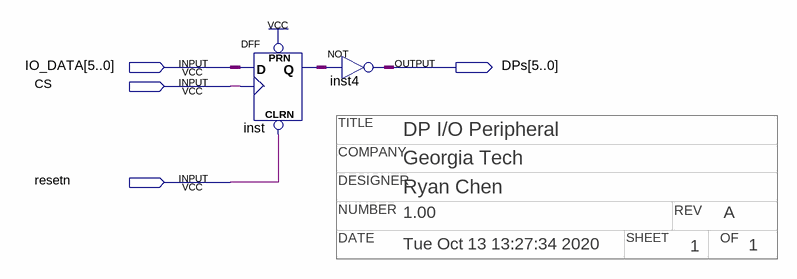
[diagram p0: schematic sheet]
// Quartus schematic DPs.bdf as structural Verilog: 2 symbols, 4 pins
// Title block: COMPANY: Georgia Tech; DATE: Tue Oct 13 13:27:34 2020; DESIGNER: Ryan Chen; NUMBER: 1.00; OF: 1; REV: A; SHEET: 1; TITLE: DP I/O Peripheral
module DPs (
  input  [5:0] IO_DATA,
  input  CS,
  input  resetn,
  output [5:0] DPs
);

  wire [5:0] inst_q;

  DFF inst[5:0] (.CLRN(resetn), .CLK(CS), .D(IO_DATA), .PRN(1'b1), .Q(inst_q));
  assign DPs = ~inst_q;  // NOT inst4, 6 bits wide
endmodule
